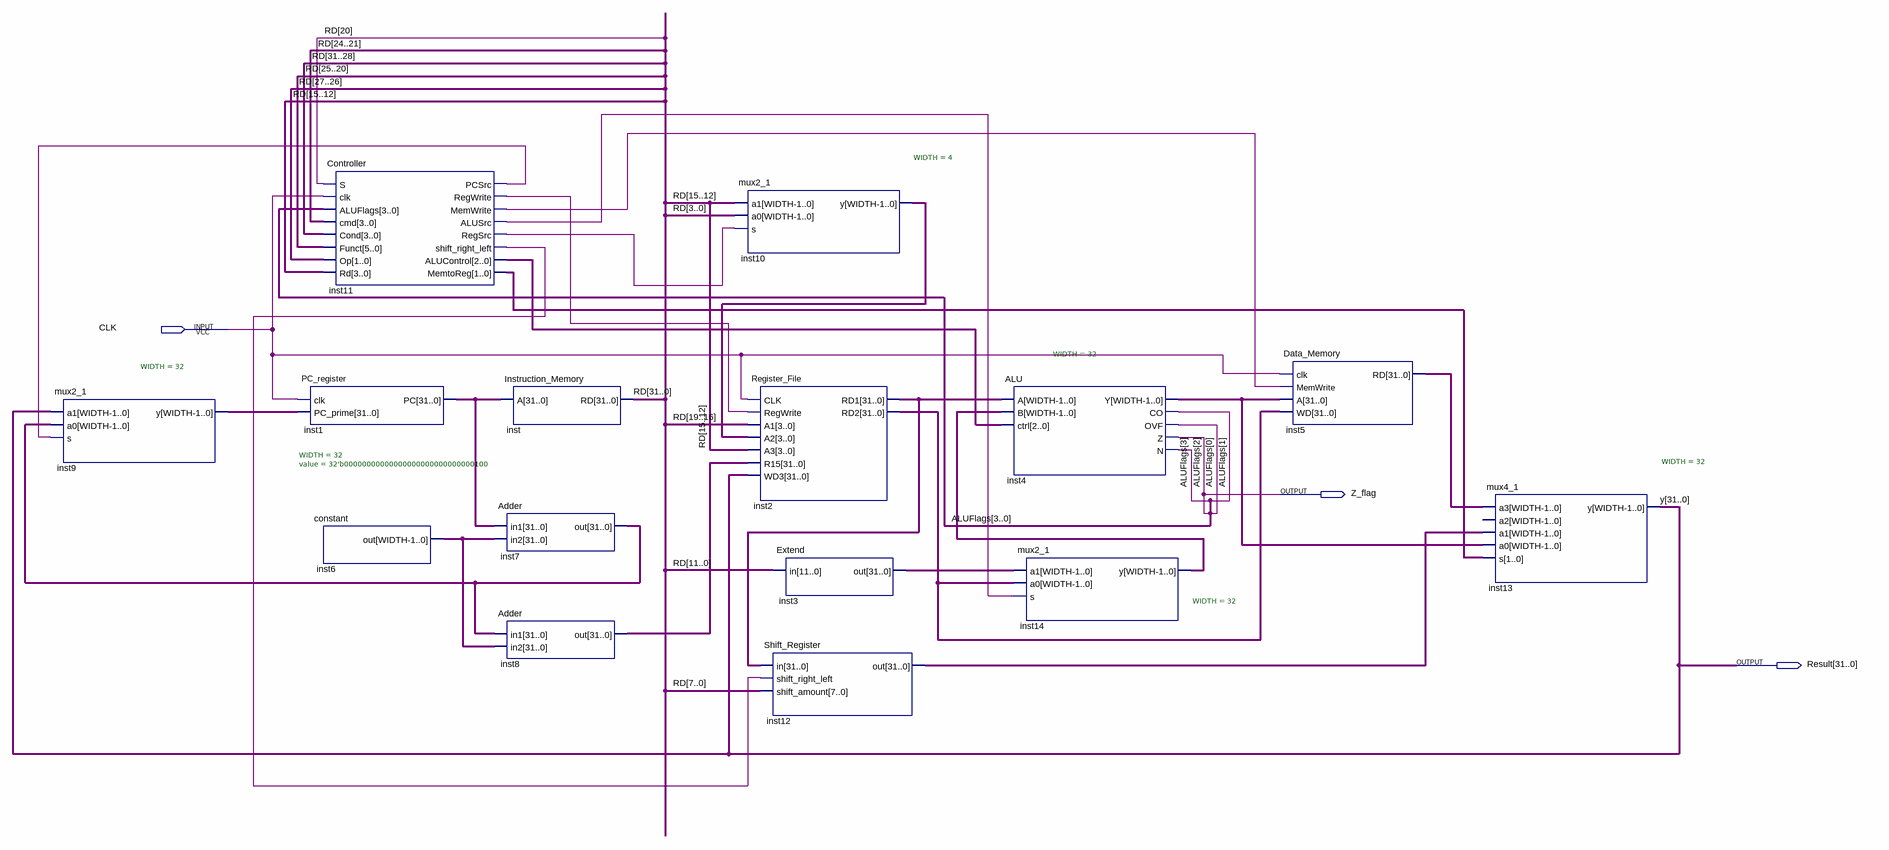
[diagram p0: schematic sheet]
// Quartus schematic Datapath.bdf as structural Verilog: 15 symbols, 3 pins
module Datapath (
  input  CLK,
  output Z_flag,
  output [31:0] Result
);

  wire inst11_alusrc, inst11_memwrite, inst11_pcsrc, inst11_regsrc, inst11_regwrite, inst11_shift_right_left;
  wire [1:0] inst11_memtoreg;
  wire [2:0] inst11_alucontrol;
  wire [3:0] ALUFlags, inst10_y;
  wire [31:0] inst1_pc, inst2_rd1, inst2_rd2, inst3_out, inst4_y, inst5_rd, inst6_out, inst7_out, inst8_out,
       inst9_y, inst12_out, inst14_y, RD;

  mux2_1 #(.WIDTH(32)) inst9 (.a1(Result), .a0(inst7_out), .s(inst11_pcsrc), .y(inst9_y));
  Controller inst11 (
    .S(RD[20]), .clk(CLK), .ALUFlags({ALUFlags[3], Z_flag, ALUFlags[1:0]}), .cmd(RD[24:21]),
    .Cond(RD[31:28]), .Funct(RD[25:20]), .Op(RD[27:26]), .Rd(RD[15:12]), .PCSrc(inst11_pcsrc),
    .RegWrite(inst11_regwrite), .MemWrite(inst11_memwrite), .ALUSrc(inst11_alusrc), .RegSrc(inst11_regsrc),
    .shift_right_left(inst11_shift_right_left), .ALUControl(inst11_alucontrol), .MemtoReg(inst11_memtoreg));
  PC_register inst1 (.clk(CLK), .PC_prime(inst9_y), .PC(inst1_pc));
  constant #(.WIDTH(32), .value(32'b00000000000000000000000000000100)) inst6 (.out(inst6_out));
  Instruction_Memory inst (.A(inst1_pc), .RD(RD));
  Adder inst7 (.in1(inst1_pc), .in2(inst6_out), .out(inst7_out));
  Adder inst8 (.in1(inst7_out), .in2(inst6_out), .out(inst8_out));
  mux2_1 #(.WIDTH(4)) inst10 (.a1(RD[15:12]), .a0(RD[3:0]), .s(inst11_regsrc), .y(inst10_y));
  Register_File inst2 (
    .CLK(CLK), .RegWrite(inst11_regwrite), .A1(RD[19:16]), .A2(inst10_y), .A3(RD[15:12]), .R15(inst8_out),
    .WD3(Result), .RD1(inst2_rd1), .RD2(inst2_rd2));
  Extend inst3 (.in(RD[11:0]), .out(inst3_out));
  Shift_Register inst12 (
    .in(inst2_rd1), .shift_right_left(inst11_shift_right_left), .shift_amount(RD[7:0]), .out(inst12_out));
  ALU #(.WIDTH(32)) inst4 (
    .A(inst2_rd1), .B(inst14_y), .ctrl(inst11_alucontrol), .Y(inst4_y), .CO(ALUFlags[1]), .OVF(ALUFlags[0]),
    .Z(Z_flag), .N(ALUFlags[3]));
  mux2_1 #(.WIDTH(32)) inst14 (.a1(inst3_out), .a0(inst2_rd2), .s(inst11_alusrc), .y(inst14_y));
  Data_Memory inst5 (.clk(CLK), .MemWrite(inst11_memwrite), .A(inst4_y), .WD(inst2_rd2), .RD(inst5_rd));
  mux4_1 #(.WIDTH(32)) inst13 (
    .a3(inst5_rd), .a1(inst12_out), .a0(inst4_y), .s(inst11_memtoreg), .y(Result));  // open: a2

  // Other names for the same wires on the sheet: ALUFlags[2] = Z_flag; y[31:0] = Result
endmodule
